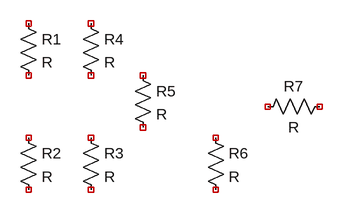
[diagram p0: schematic Draft2.asc]
Draft2.asc, the LTspice schematic file:
Version 4
SHEET 1 880 680
SYMBOL res 80 48 R0
SYMATTR InstName R1
SYMBOL res 80 224 R0
SYMATTR InstName R2
SYMBOL res 176 224 R0
SYMATTR InstName R3
SYMBOL res 176 48 R0
SYMATTR InstName R4
SYMBOL res 256 128 R0
SYMATTR InstName R5
SYMBOL res 368 224 R0
SYMATTR InstName R6
SYMBOL res 560 176 R90
WINDOW 0 0 56 VBottom 2
WINDOW 3 32 56 VTop 2
SYMATTR InstName R7

The netlist it stands for:
* Draft2.asc
R1 NC_01 NC_02 R
R2 NC_03 NC_04 R
R3 NC_05 NC_06 R
R4 NC_07 NC_08 R
R5 NC_09 NC_10 R
R6 NC_11 NC_12 R
R7 NC_13 NC_14 R
.backanno
.end